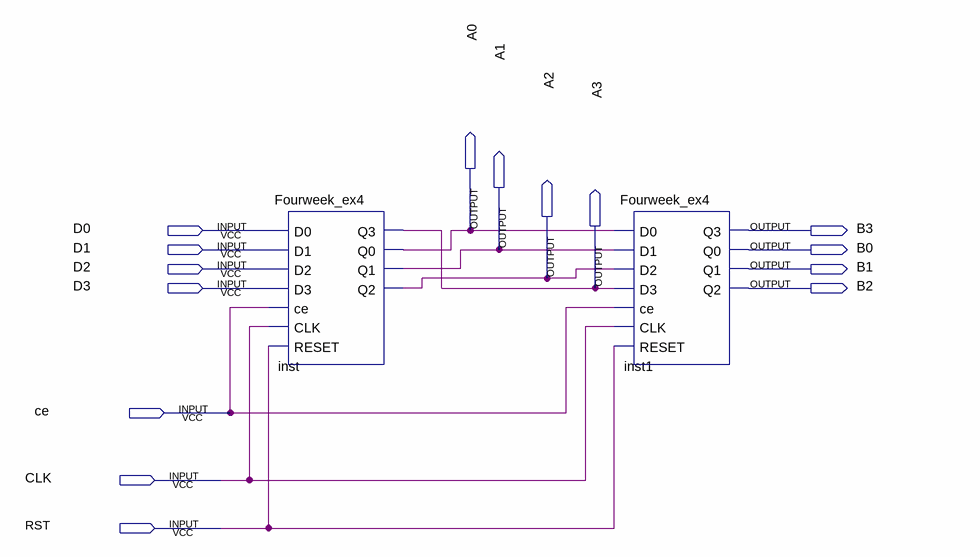
[diagram p0: schematic sheet]
// Quartus schematic Fourweek_ex5.bdf as structural Verilog: 2 symbols, 15 pins
module Fourweek_ex5 (
  input  D0,
  input  D1,
  input  D2,
  input  D3,
  input  ce,
  input  CLK,
  input  RST,
  output A0,
  output B3,
  output A1,
  output B0,
  output B1,
  output A2,
  output A3,
  output B2
);

  Fourweek_ex4 inst (
    .D0(D0), .D1(D1), .D2(D2), .D3(D3), .ce(ce), .CLK(CLK), .RESET(RST), .Q3(A3), .Q0(A0), .Q1(A1), .Q2(A2));
  Fourweek_ex4 inst1 (
    .D0(A0), .D1(A1), .D2(A2), .D3(A3), .ce(ce), .CLK(CLK), .RESET(RST), .Q3(B3), .Q0(B0), .Q1(B1), .Q2(B2));
endmodule
